# Altium schematic sheet DAC_and_MIC.SchDoc
size A4; SheetNumber: 8; SheetTotal: 8
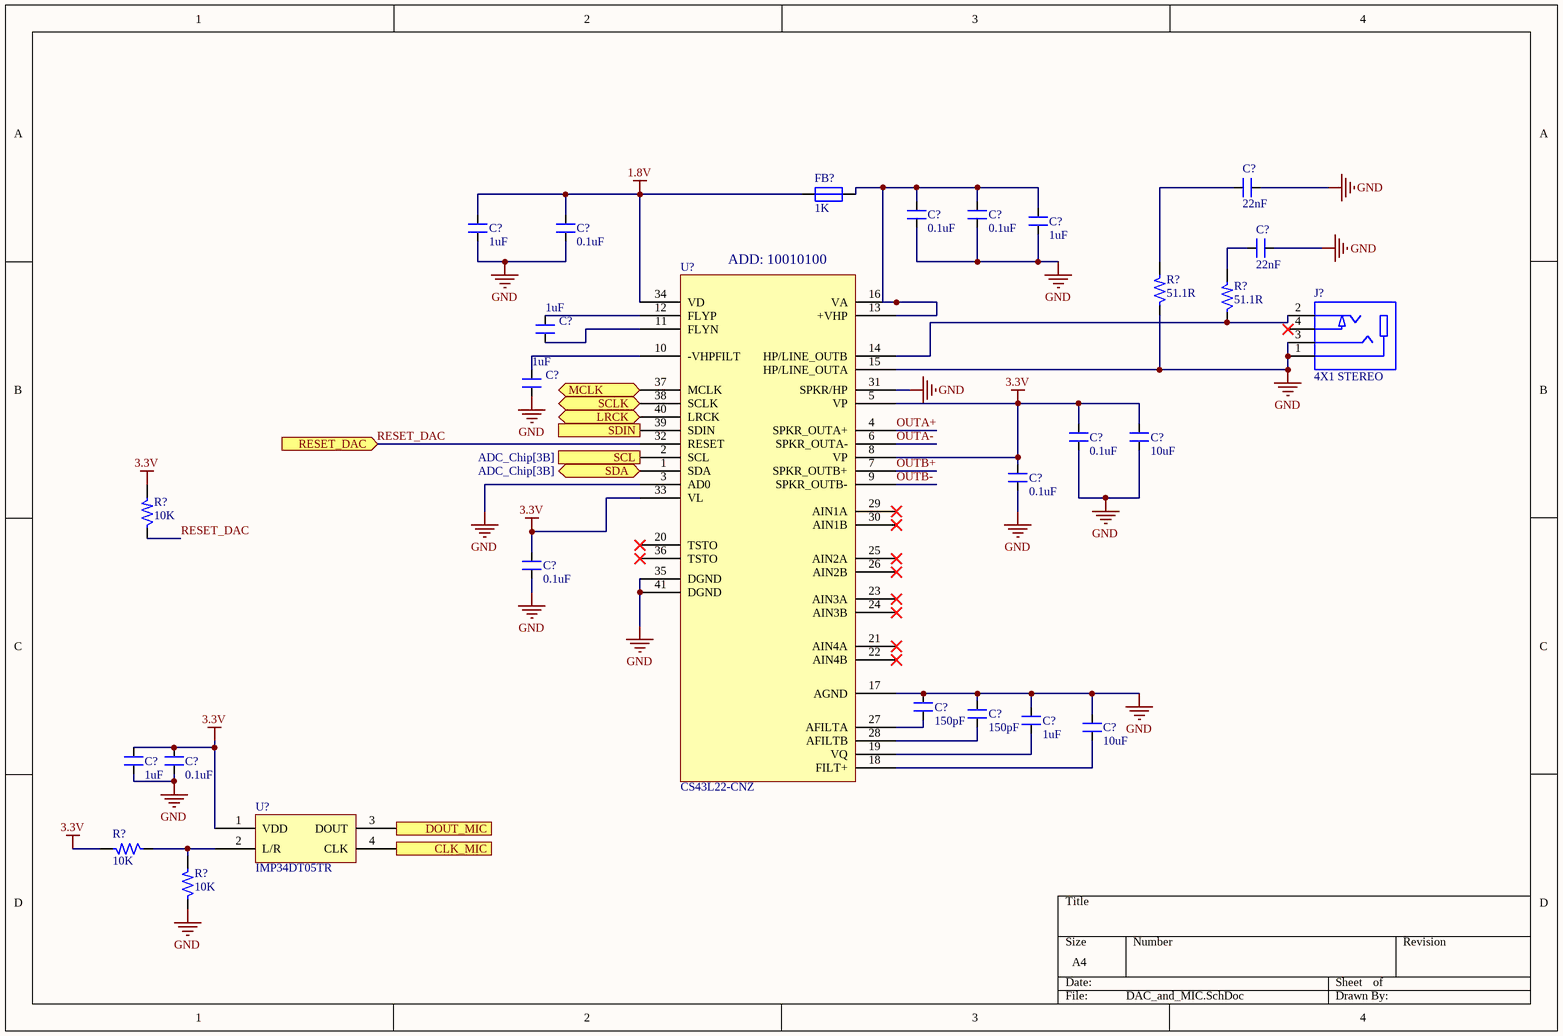
[diagram p0: DAC_and_MIC.SchDoc]

## Parts
(Parts that share a designator on the sheet are numbered #1, #2 ... from top to bottom, then left to right.)
C?#1  22nF
C?#2  0.1uF  [CAP_0805]
C?#3  0.1uF  [CAP_0805]
C?#4  1uF  [CAP_0805]
C?#5  1uF  [CAP_0805]
C?#6  0.1uF  [CAP_0805]
C?#7  22nF
C?#8  1uF  [CAP_0805]
C?#9  1uF  [CAP_0805]
C?#10  0.1uF  [CAP_0805]
C?#11  10uF  [CAP_1206]
C?#12  0.1uF  [CAP_0805]
C?#13  0.1uF  [CAP_0805]
C?#14  150pF
C?#15  1uF  [CAP_0805]
C?#16  150pF
C?#17  10uF  [CAP_1206]
C?#18  1uF  [CAP_0805]
C?#19  0.1uF  [CAP_0805]
FB?  1K  [IND_0805]
J?  4X1 STEREO  [CON_SJ-2504A-SMT-TR_SMD]
R?#1  51.1R  [RES_0603]
R?#2  51.1R  [RES_0603]
R?#3  10K  [RES_0805]
R?#4  10K  [RES_0805]
R?#5  10K  [RES_0805]
U?#1  CS43L22-CNZ  [QFN40_19_284_33X9_SMD]
U?#2  IMP34DT05TR

## Ports
CLK_MIC (in), DOUT_MIC (out), LRCK (bidir), MCLK (bidir), RESET_DAC (in), SCL (in, see ADC_Chip[3B]), SCLK (bidir), SDA (bidir, see ADC_Chip[3B]), SDIN (in)

## Nets
1.8V: C?#5.1 C?#6.2 FB?.1 U?#1.34(VD)
3.3V: C?#10.2 C?#11.2 C?#12.2 C?#13.2 C?#18.2 C?#19.2 R?#3.2 R?#4.2 U?#1.5(VP) U?#1.8(VP) U?#1.33(VL) U?#2.1(VDD)
GND: C?#1.1 C?#2.1 C?#3.1 C?#4.1 C?#5.2 C?#6.1 C?#7.1 C?#9.2 C?#10.1 C?#11.1 C?#12.1 C?#13.1 C?#14.2 C?#15.2 C?#16.2 C?#17.2 C?#18.1 C?#19.1 J?.1 J?.3 R?#1.1 R?#5.1 U?#1.3(AD0) U?#1.15(HP/LINE_OUTA) U?#1.17(AGND) U?#1.31(SPKR/HP) U?#1.35(DGND) U?#1.41(DGND)
CLK_MIC: U?#2.4(CLK) ; port CLK_MIC
DOUT_MIC: U?#2.3(DOUT) ; port DOUT_MIC
LRCK: U?#1.40(LRCK) ; port LRCK
MCLK: U?#1.37(MCLK) ; port MCLK
OUTA+: U?#1.4(SPKR_OUTA+)
OUTA-: U?#1.6(SPKR_OUTA-)
OUTB+: U?#1.7(SPKR_OUTB+)
OUTB-: U?#1.9(SPKR_OUTB-)
RESET_DAC: U?#1.32(RESET) ; port RESET_DAC
RESET_DAC: R?#3.1  [a separate net that carries the same name]
SCL: U?#1.2(SCL) ; port SCL
SCLK: U?#1.38(SCLK) ; port SCLK
SDA: U?#1.1(SDA) ; port SDA
SDIN: U?#1.39(SDIN) ; port SDIN
NetC?#1_2: C?#1.2 R?#1.2
NetC?#2_2: C?#2.2 C?#3.2 C?#4.2 FB?.2 U?#1.13(+VHP) U?#1.16(VA)
NetC?#7_2: C?#7.2 R?#2.2
NetC?#8_1: C?#8.1 U?#1.12(FLYP)
NetC?#8_2: C?#8.2 U?#1.11(FLYN)
NetC?#9_1: C?#9.1 U?#1.10(-VHPFILT)
NetC?#14_1: C?#14.1 U?#1.27(AFILTA)
NetC?#15_1: C?#15.1 U?#1.19(VQ)
NetC?#16_1: C?#16.1 U?#1.28(AFILTB)
NetC?#17_1: C?#17.1 U?#1.18(FILT+)
NetJ?_2: J?.2 R?#2.1 U?#1.14(HP/LINE_OUTB)
NetR?#4_1: R?#4.1 R?#5.2 U?#2.2(L/R)

Not connected (* = marked no-connect by the designer): J? 4*; U?#1 20(TSTO)* 21(AIN4A)* 22(AIN4B)* 23(AIN3A)* 24(AIN3B)* 25(AIN2A)* 26(AIN2B)* 29(AIN1A)* 30(AIN1B)* 36(TSTO)*

## Notes on the sheet
- (near U?#1) ADD: 10010100
- Labels drawn without touching a wire or pin: RESET_DAC

## Library data of the parts
C?#1 C?#7 = CAP_22nF-50V-1%-0805
C?#2 C?#3 C?#6 C?#10 C?#12 C?#13 C?#19 = CAP_0.1uF-50V-10%-0805: 0.1µF ±10% 50V Ceramic Capacitor X7R 0805 (2012 Metric); Manufacturer: Samsung; Manufacturer Part Number: CL21B104KBCNNNC; Alternate Part Number-1: NA; Case/Package: 0805; Supplier-1: SIRICOM; Supplier Part Number-1: 0805B104K500CT
C?#4 C?#5 C?#8 C?#9 C?#15 C?#18 = CAP_1uF-50V-5%-0805: 1µF ±5% 50V Ceramic Capacitor X7R 0805 (2012 Metric); Manufacturer: Samsung; Manufacturer Part Number: CC0805JKX7R9BB105; Alternate Part Number-1: 0805F105M500NT; Case/Package: 0805; Supplier-1: SIRICOM; Supplier Part Number-1: CL21B105KBFNNNE
C?#11 C?#17 = CAP_10uF-50V-10%-1206: 10µF ±10% 50V Ceramic Capacitor X7R 1206 (3216 Metric); Manufacturer: KEMET; Manufacturer Part Number: CL31B106KBHNNNE; Alternate Part Number-1: GRT31CR61H106ME01L; Case/Package: 1206; Supplier-1: SIRICOM; Supplier Part Number-1: CC1206KKX5R9BB106
C?#14 C?#16 = CAP_150pF-50V-20%-0805
FB? = FB_1K-100MHZ-1.6A-0805: 1 kOhms @ 100MHz 1 Power Line Ferrite Bead 0805 (2012 Metric) 1.6A; Manufacturer: Laird; Manufacturer Part Number: BLM21SP102SH1D; Alternate Part Number-1: NA; Case/Package: 0805; Supplier-1: SIRICOM; Supplier Part Number-1: ACMS201209A102
J? = CON-PLG-STEREO_4X1-100-RA-SMD: 2.50mm (0.094", 3/32", Sub Mini, Miniature) - Headphone Phone Jack Stereo (4 Conductor, TRRS) Connector Solder; Manufacturer: CUI Devices; Manufacturer Part Number: SJ-2504A-SMT-TR; Alternate Part Number-1: NA; Case/Package: SMD; Supplier Part Number-1: CP-SJ-2504A-SMT-CT-ND - Cut Tape (CT); Supplier-1: Digikey
R?#1 R?#2 = RES_51.1R-0.1W-1%-0603: 51.1 Ohms ±1% 0.1W, 1/10W Chip Resistor 0603 (1608 Metric) Thick Film; Manufacturer: Vishay Dale; Manufacturer Part Number: CRCW060351R1FKEAC; Alternate Part Number-1: NA; Case/Package: 0603; Supplier-1: Digikey; Supplier Part Number-1: 541-5468-1-ND - Cut Tape (CT)
R?#3-R?#5 = RES_10K-0.125W-1%-0805: 10 kOhms ±1% 0.125W, 1/8W Chip Resistor 0805 (2012 Metric) Automotive AEC-Q200 Thick Film; Manufacturer: CTS; Manufacturer Part Number: WR08X1002FTL; Case/Package: 0805; Supplier-1: SIRICOM; Supplier Part Number-1: WR08X1002FTL; Alternate Part Number-1: WR08X1002FTL
U?#1 = IC_CS43L22: Audio D/A Converter ICs Low Power Stereo DAC w/ClassD Spkr Driver; Manufacturer: Cirrus Logic; Alternate Part Number-1: NA; Manufacturer Part Number: CS43L22-CNZ; Case/Package: QFN-40; Supplier-1: Mouser; Supplier Part Number-1: 777-CS43L22-CNZ
U?#2 = IC_IMP34DT05T